# Altium schematic sheet final_sch.SchDoc
size A3; SheetNumber: 1; SheetTotal: 1
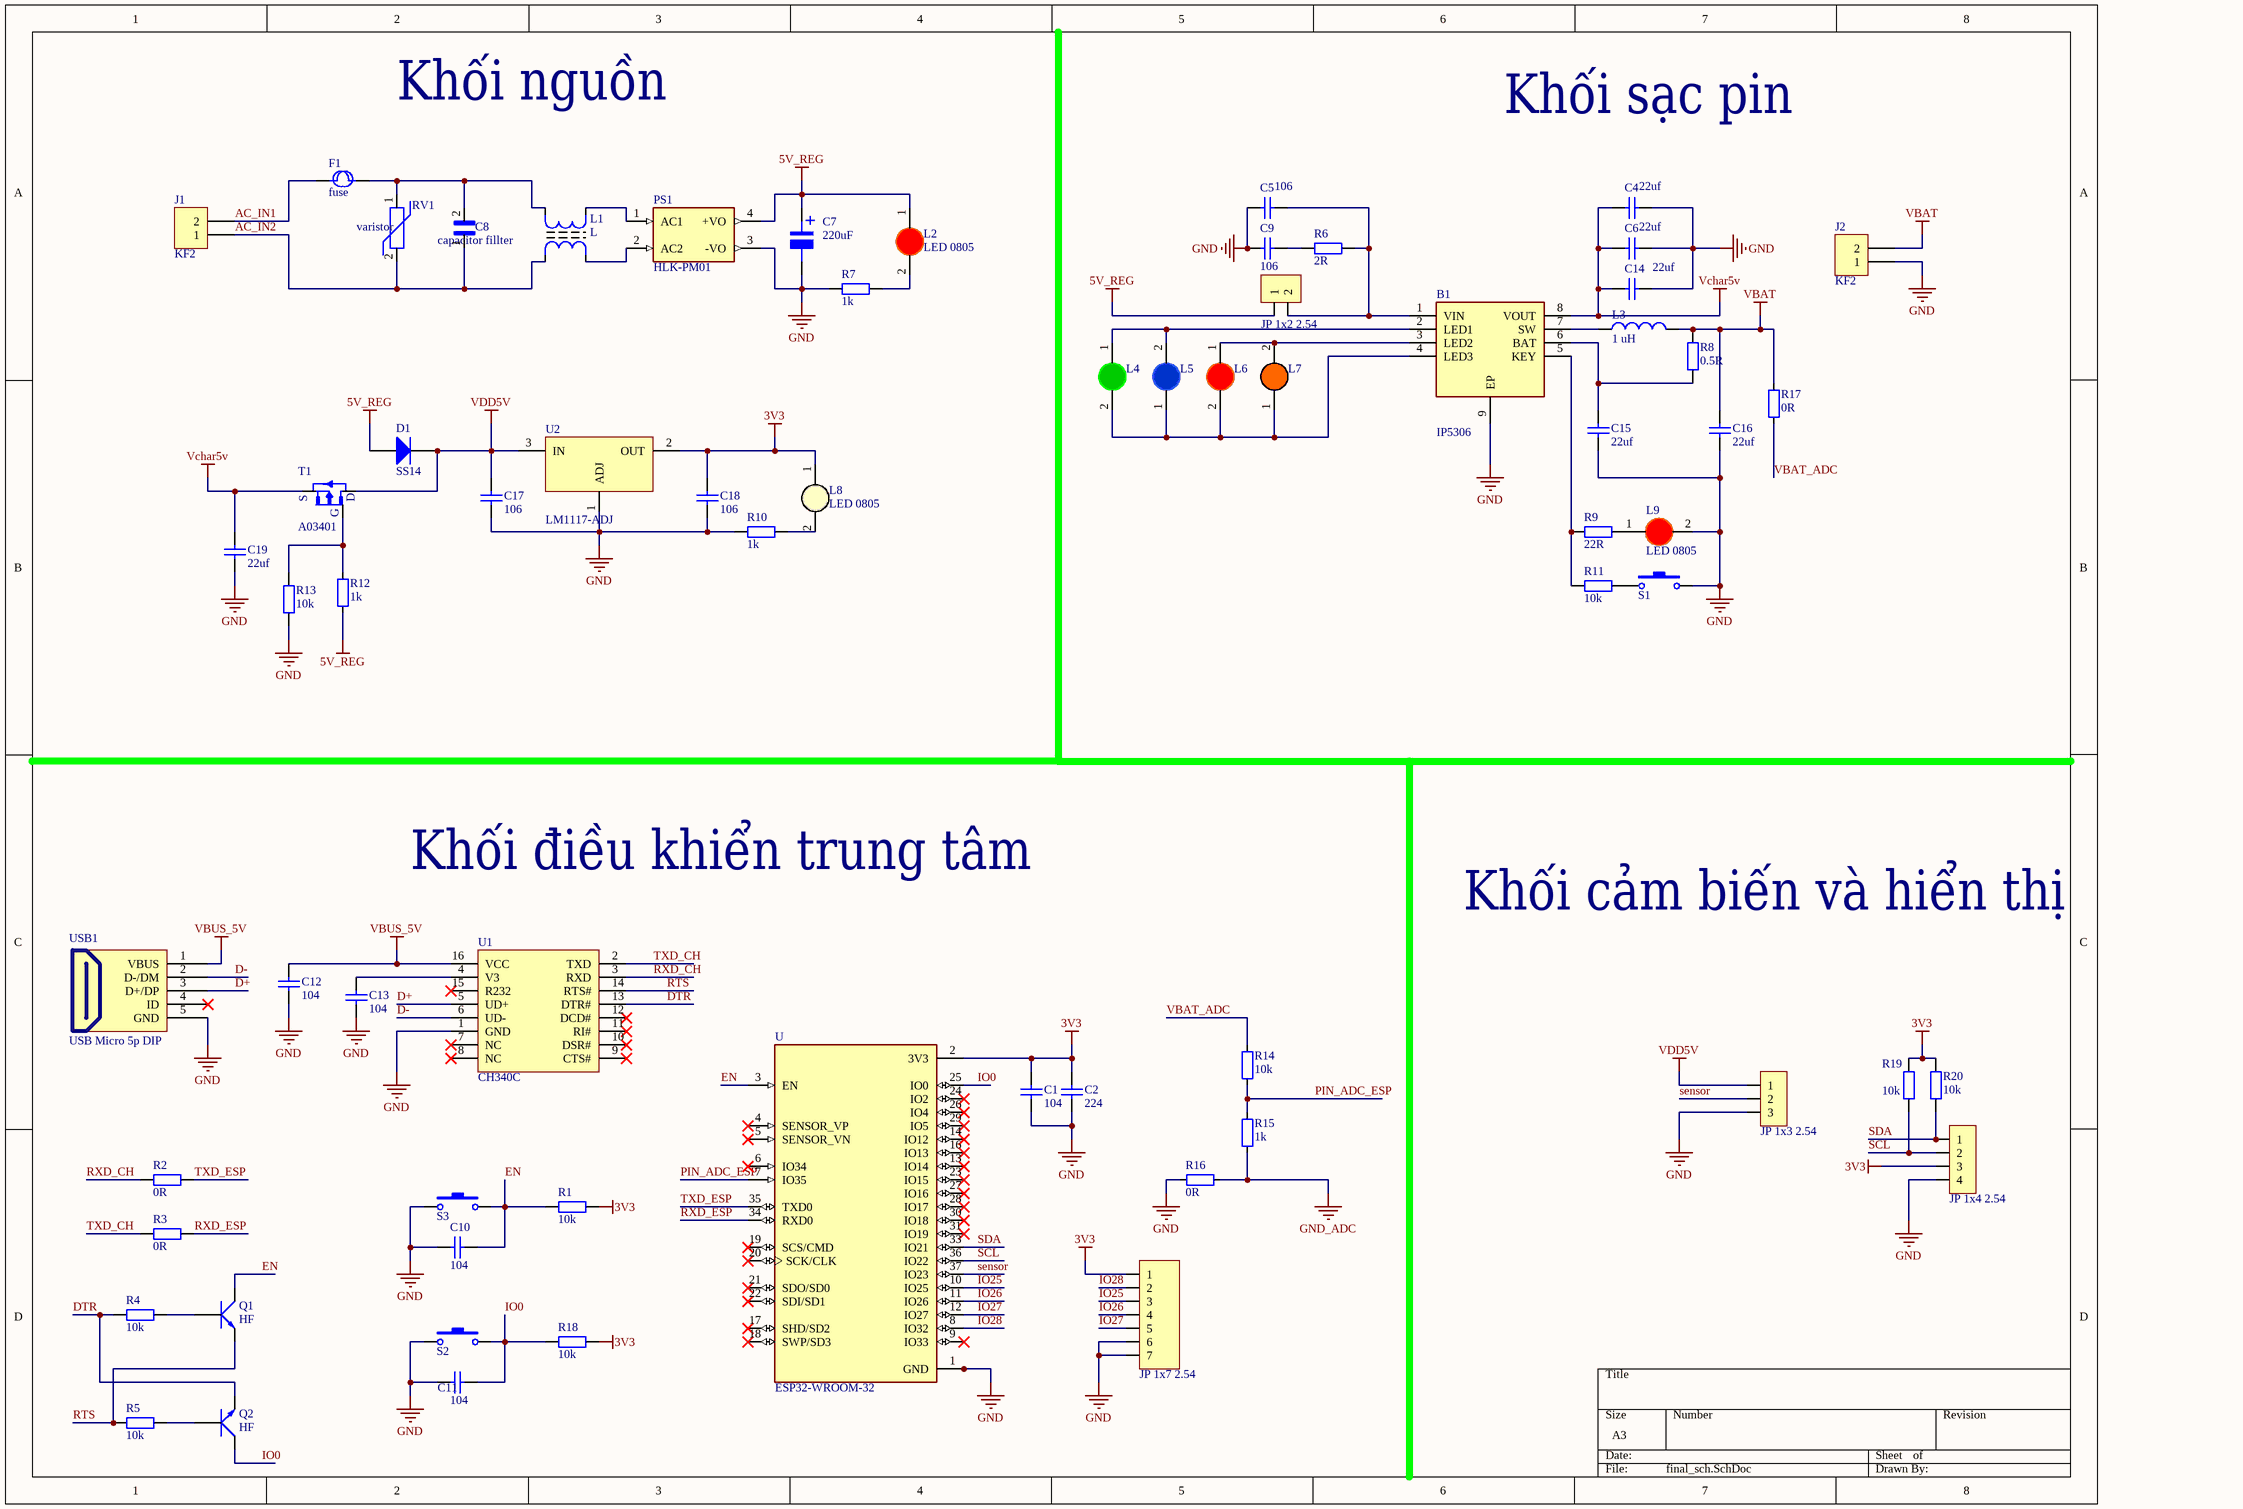
[diagram p0: final_sch.SchDoc]

## Parts
B1  IP5306  [SOIC127P600X165-9N]
C1  104  [tu 0805]
C2  224  [tu 0805]
C4  22uf  [tu 0805]
C5  106  [tu 0805]
C6  22uf  [tu 0805]
C7  220uF  [tu nhom 10 (g)]
C8  capacitor fillter  [CAPRR1000W60L1300T600H1200]
C9  106  [tu 0805]
C10  104  [tu 0805]
C11  104  [tu 0805]
C12  104  [tu 0805]
C13  104  [tu 0805]
C14  22uf  [tu 0805]
C15  22uf  [tu 0805]
C16  22uf  [tu 0805]
C17  106  [tu 0805]
C18  106  [tu 0805]
C19  22uf  [tu 0805]
D1  SS14  [DIODE SMA]
F1  fuse  [F2-5.1-11.4X3.0X18.3MM]
J1  KF2  [KF2-3.5]
J2  KF2  [KF2-3.5]
JP1  JP 1x4 2.54  [JP 1x4 CT]
JP2  JP 1x3 2.54  [JP 1x3 DT]
JP3  JP 1x7 2.54  [JP 1x7 CT]
JP4  JP 1x2 2.54  [JP 1x2 DT]
L1  L  [L-DIP-220]
L2  LED 0805  [LED-0805-Red]
L3  1 uH  [IND_90.5_141.7_125X31_SMD]
L4  (no value)  [LED-0805-Green]
L5  (no value)  [LED-0805-Blue]
L6  (no value)  [LED-0805-Red]
L7  (no value)  [LED-0805-Orange]
L8  LED 0805  [LED-0805-Yellow]
L9  LED 0805  [LED-0805-Red]
PS1  HLK-PM01  [CONV_HLK-PM01]
Q1  HF  [SOT23]
Q2  HF  [SOT23]
R1  10k  [tro smd 0805]
R2  0R  [tro smd 0805]
R3  0R  [tro smd 0805]
R4  10k  [tro smd 0805]
R5  10k  [tro smd 0805]
R6  2R  [tro smd 0805]
R7  1k  [tro smd 0805]
R8  0.5R  [tro smd 0805]
R9  22R  [tro smd 0805]
R10  1k  [tro smd 0805]
R11  10k  [tro smd 0805]
R12  1k  [RES-SMD-0805]
R13  10k  [tro smd 0805]
R14  10k  [RES-SMD-0805]
R15  1k  [RES-SMD-0805]
R16  0R  [RES-SMD-0805]
R17  0R  [RES-SMD-0805]
R18  10k  [tro smd 0805]
R19  10k  [tro smd 0805]
R20  10k  [tro smd 0805]
RV1  varistor  [MOV14D471K]
S1  SW-SMD  [SW-SMD]  (value not drawn)
S2  SW-SMD  [SW-SMD]  (value not drawn)
S3  SW-SMD  [SW-SMD]  (value not drawn)
T1  A03401  [A3401]
U  ESP32-WROOM-32  [MODULE_ESP32-WROOM-32]
U1  CH340C  [SOIC16_50_284_25X90_SMT]
U2  LM1117-ADJ  [LM1117-SOP]
USB1  USB Micro 5p DIP  [USB Micro 5p DIP]

## Nets
3V3: C1.2 C2.1 C18.1 JP1.3 JP3.1 L8.1(A) R1.2 R18.1 R19.1 R20.1 U.2(3V3) U2.2(OUT)
5V_REG: C7.1 D1.1(A) JP4.1 L2.1(A) PS1.4(+VO) R12.1
GND: B1.9(EP) C1.1 C2.2 C4.1 C5.2 C6.1 C7.2 C9.2 C10.2 C11.2 C12.2 C13.2 C14.2 C15.1 C16.2 C17.2 C18.2 C19.2 J2.1 JP1.4 JP2.3 JP3.6 JP3.7 L9.2(K) PS1.3(-VO) R7.2 R10.2 R13.1 R16.2 S1.2 S2.1 S3.1 U.1(GND) U.15(GND) U.38(GND) U.39_1(GND) U.39_2(GND) U.39_3(GND) U.39_4(GND) U.39_5(GND) U.39_6(GND) U.39_7(GND) U.39_8(GND) U.39_9(GND) U.39_10(GND) U.39_11(GND) U.39_12(GND) U.39_13(GND) U.39_14(GND) U.39_15(GND) U.39_16(GND) U.39_17(GND) U.39_18(GND) U.39_19(GND) U.39_20(GND) U.39_21(GND) U1.1(GND) U2.1(ADJ) USB1.5(GND)
GND_ADC: R15.1 R16.1
VBAT: C16.1 J2.2 L3.2 R8.2 R17.1
VBUS_5V: C12.1 U1.16(VCC) USB1.1(VBUS)
Vchar5v: B1.8(VOUT) C4.2 C6.2 C14.1 C19.1 T1.2(S)
VDD5V: C17.1 D1.2(K) JP2.1 T1.3(D) U2.3(IN)
AC_IN1: F1.1 J1.2
AC_IN2: C8.1 J1.1 L1.1 RV1.2
D+: U1.5(UD+) USB1.3(D+/DP)
D-: U1.6(UD-) USB1.2(D-/DM)
DTR: Q2.2(E) R4.2 U1.13(DTR#)
EN: C10.1 Q1.3(C) R1.1 S3.2 U.3(EN)
IO0: C11.1 Q2.3(C) R18.2 S2.2 U.25(IO0)
IO25: JP3.3 U.10(IO25)
IO26: JP3.4 U.11(IO26)
IO27: JP3.5 U.12(IO27)
IO28: JP3.2 U.8(IO32)
PIN_ADC_ESP: R14.1 R15.2 U.7(IO35)
RTS: Q1.2(E) R5.2 U1.14(RTS#)
RXD_CH: R2.1 U1.3(RXD)
RXD_ESP: R3.2 U.34(RXD0)
SCL: JP1.2 R19.2 U.36(IO22)
SDA: JP1.1 R20.2 U.33(IO21)
sensor: JP2.2 U.37(IO23)
TXD_CH: R3.1 U1.2(TXD)
TXD_ESP: R2.2 U.35(TXD0)
VBAT_ADC: R14.2 R17.2
NetB1_1: B1.1(VIN) C5.1 JP4.2 R6.2
NetB1_2: B1.2(LED1) L4.1(A) L5.2(K)
NetB1_3: B1.3(LED2) L6.1(A) L7.2(K)
NetB1_4: B1.4(LED3) L4.2(K) L5.1(A) L6.2(K) L7.1(A)
NetB1_5: B1.5(KEY) R9.1 R11.1
NetB1_6: B1.6(BAT) C15.2 R8.1
NetB1_7: B1.7(SW) L3.1
NetC8_2: C8.2 F1.2 L1.4 RV1.1
NetC9_1: C9.1 R6.1
NetC13_1: C13.1 U1.4(V3)
NetL1_2: L1.2 PS1.2(AC2)
NetL1_3: L1.3 PS1.1(AC1)
NetL2_2: L2.2(K) R7.1
NetL8_2: L8.2(K) R10.1
NetL9_1: L9.1(A) R9.2
NetQ1_1: Q1.1(B) R4.1
NetQ2_1: Q2.1(B) R5.1
NetR11_2: R11.2 S1.1
NetR12_2: R12.2 R13.2 T1.1(G)

Not connected (* = marked no-connect by the designer): U 4(SENSOR_VP)* 5(SENSOR_VN)* 6(IO34)* 9(IO33)* 13(IO14)* 14(IO12)* 16(IO13)* 17(SHD/SD2)* 18(SWP/SD3)* 19(SCS/CMD)* 20(SCK/CLK)* 21(SDO/SD0)* 22(SDI/SD1)* 23(IO15)* 24(IO2)* 26(IO4)* 27(IO16)* 28(IO17)* 29(IO5)* 30(IO18)* 31(IO19)*; U1 7(NC)* 8(NC)* 9(CTS#)* 10(DSR#)* 11(RI#)* 12(DCD#)* 15(R232)*; USB1 4(ID)*

## Notes on the sheet
- Khối nguồn
- Khối sạc pin
- Khối điều khiển trung tâm
- Khối cảm biến và hiển thị
- (in symbol Tu Nhom 220uF 50V) +

## Library data of the parts
B1 = IP5306: Fully-Integrated Power-Bank System-On-Chip; Manufacturer_Name: INJOINIC; Geometry.Height: 1.65mm; Manufacturer_Part_Number: IP5306; Mouser Part Number: *; Mouser Price/Stock: *; Arrow Part Number: *; Arrow Price/Stock: *; Datasheet Link: https://datasheetspdf.com/pdf-file/1139129/Injoinic/IP5306/1
C1 C10-C13 = Tu 0805 104 50V 10%: Dán; Don_Vi: Con; So_Chan: 2; Ten_Linh_Kien: Tụ 0805 104-100nF 10% 50V; Ma_Hang: MH004551; Chung_Loai: Dán; Kieu_Chan: *
C2 = Tu 0805 224 50V 10%: Dán; Don_Vi: Con; So_Chan: 2; Ten_Linh_Kien: Tụ 0805 224-0.22uF 10% 50V; Ma_Hang: MH004559; Chung_Loai: Dán; Kieu_Chan: *
C4 C6 C14-C16 C19 = Tu 0805 225 25V 10%: Dán; Don_Vi: Con; So_Chan: 2; Ten_Linh_Kien: Tụ 0805 225-2.2uF 25V 10%; Ma_Hang: MH007483; Chung_Loai: Dán; Kieu_Chan: *
C5 C9 C17 C18 = Tu 0805 106 16V 10%: Dán; Ten_Linh_Kien: Tụ 0805 106-10uF 10% 16V; So_Chan: 2; Don_Vi: Con; Ma_Hang: MH004553; Chung_Loai: Dán; Kieu_Chan: *
C7 = Tu Nhom 220uF 50V: Dán; Don_Vi: Con; So_Chan: 2; Ten_Linh_Kien: Tụ Nhôm 220uF 50V 10x10.2MM; Ma_Hang: MH002228; Chung_Loai: Dán; Kieu_Chan: *
C8 = B32921C3104M003: Safety Capacitors FILM CAP MKP X2 0.10uF 20% 305Vac LS 10mm - short leads; MF: TDK; Package: None; Price: None; MP: B32921C3104M003; Availability: In Stock; Value: *; Check_prices: https://www.snapeda.com/parts/B32921C3104M003/TDK/view-part/?ref=eda; Purchase-URL: https://pricing.snapeda.com/search/part/B32921C3104M003/?ref=eda; SnapEDA_Link: https://www.snapeda.com/parts/B32921C3104M003/TDK/view-part/?ref=snap
D1 = Diode SS14 ( 1N5819): Dán; Ma_Hang: MH002211; Don_Vi: Con; Ten_Linh_Kien: Diode SS14 DO214 Schottky 1A 40V ( 1N5819 DO214); Chung_Loai: Dán; Ghi_Chu: *; Kieu_Chan: *
F1 = DIP-PPTC-2.5A-30V(D11.4MM): Polymeric PTC Resettable Fuse 30V 2.5A Ih Through Hole Radial, Disc; MF: Littelfuse; MP: 30R250; Value: *; Price: None; Package: Radial Littelfuse; SnapEDA_Link: https://www.snapeda.com/parts/30R250/Littelfuse/view-part/4772985/?ref=snap; Availability: Bad; Check_prices: https://www.snapeda.com/parts/30R250/Littelfuse/view-part/4772985/?ref=eda
J1 J2 = KF2: Manufacturer: Würth Elektronik eiSos GmbH; partNo: 691103110002; ComponentLink1 Description: Manufacturer; ComponentLink2 Description: Datasheet; NoPins: 2; Created Date: 29 October 2013; ComponentLink1URL: http://www.we-online.com; ComponentLink2URL: http://katalog.we-online.de/em/datasheet/6911031100xx.pdf; Created by: Karrer Zheng
JP1 = JP 1x4 2.54 Cai Thang: Cắm; Ten_Linh_Kien: Jump Đơn Cái 2.54MM 1x20P Thẳng; Don_Vi: Con; Ma_Hang: MH004006; Ghi_Chu: *; Kieu_Chan: *; Chung_Loai: Cắm
JP2 = JP 1x3 2.54 Duc Thang: Cắm; Ten_Linh_Kien: Jump Đơn Đực 2.54MM 1x40P Thẳng 11MM; Don_Vi: Con; Ma_Hang: MH000903; Ghi_Chu: *; Kieu_Chan: *; Chung_Loai: Cắm
JP3 = JP 1x7 2.54 Cai Thang: Cắm; Ten_Linh_Kien: Jump Đơn Cái 2.54MM 1x20P Thẳng; Don_Vi: Con; Ma_Hang: MH004006; Ghi_Chu: *; Kieu_Chan: *; Chung_Loai: Cắm
JP4 = JP 1x2 2.54 Duc Thang: Cắm; Ten_Linh_Kien: Jump Đơn Đực 2.54MM 1x40P Thẳng 11MM; Don_Vi: Con; Ma_Hang: MH000903; Ghi_Chu: *; Kieu_Chan: *; Chung_Loai: Cắm
L1 = L-DIP-220: Inductor; Value: Loc 220; Designed by: VanDungEvn
L2 L6 L9 = LED 0805 Do: Dán; Don_Vi: Con; Ma_Hang: MH000897; Ten_Linh_Kien: LED 0805 Màu Đỏ (Red); Ghi_Chu: *; Kieu_Chan: *; Chung_Loai: Dán
L3 = IND_1uH-4.2A-20%-SMD: Fixed Inductors WPN3012H1R0MT 100kHz; Manufacturer: Sunlord; Alternate Part Number-1: NA; Manufacturer Part Number: WPN3012H1R0MT; Case/Package: SMD; Supplier-1: NA; Supplier Part Number-1: NA
L4 = LED 0805 Xanh La: Dán; Don_Vi: Con; Ma_Hang: MH002326; Ten_Linh_Kien: LED 0805 Màu Xanh Lá (Green); Ghi_Chu: *; Kieu_Chan: *; Chung_Loai: Dán
L5 = LED 0805 Xanh Duong: Dán; Don_Vi: Con; Ma_Hang: MH002327; Ten_Linh_Kien: LED 0805 Màu Xanh Dương (Blue); Ghi_Chu: *; Kieu_Chan: *; Chung_Loai: Dán
L7 = LED 0805 Cam: Dán; Don_Vi: Con; Ma_Hang: MH002328; Ten_Linh_Kien: LED 0805 Màu Cam ( Orange); Ghi_Chu: *; Kieu_Chan: *; Chung_Loai: Dán
L8 = LED 0805 Trang: Dán; Don_Vi: Con; Ma_Hang: MH002946; Ten_Linh_Kien: LED 0805 Màu Trắng ( White); Ghi_Chu: *; Kieu_Chan: *; Chung_Loai: Dán
PS1 = HLK-PM01: The HLK-PM01 is a small size low cost AC to DC converter which can take in 110V/220V AC at 50/60 Hz and give 5V 3W output. The module is can be used in designs which run on 5V and needs to be powered form the AC mains.; MF: Hi-link; Package: None; Price: None; Value: *; SnapEDA_Link: https://www.snapeda.com/parts/hlk-pm01/Hi-link/view-part/?ref=snap; MP: hlk-pm01; Availability: Not in stock; Check_prices: https://www.snapeda.com/parts/hlk-pm01/Hi-link/view-part/?ref=eda
Q1 Q2 = C1815 HF SMD: NPN transistor; Value: C9014
R1 R4 R5 R18 = Tro 0805 5% 10k: Dán; Don_Vi: Con; So_Chan: 2; Ten_Linh_Kien: Trở 0805 5% 10k; Ma_Hang: MH005239; Chung_Loai: Dán; Kieu_Chan: *
R2 R3 = Tro 0805 5% 0R: Dán; Don_Vi: Con; So_Chan: 2; Ten_Linh_Kien: Trở 0805 5% 0R; Ma_Hang: MH005230; Chung_Loai: Dán; Kieu_Chan: *
R6 = Tro 0805 5% 1R: Dán; Don_Vi: Con; So_Chan: 2; Ten_Linh_Kien: Trở 0805 5% 1R; Ma_Hang: MH005236; Chung_Loai: Dán; Kieu_Chan: *
R7 R10 = Tro 0805 1% 1k: Dán; Don_Vi: Con; So_Chan: 2; Ten_Linh_Kien: Trở 0805 1% 1k; Ma_Hang: MH005468; Chung_Loai: Dán; Kieu_Chan: *
R8 = Tro 0805 1% 0.5R: Dán; Don_Vi: Con; So_Chan: 2; Ten_Linh_Kien: Trở 0805 1% 0.5R; Ma_Hang: MH005465; Chung_Loai: Dán; Kieu_Chan: *
R9 = Tro 0805 5% 22R: Dán; Don_Vi: Con; So_Chan: 2; Ten_Linh_Kien: Trở 0805 5% 22R; Ma_Hang: MH005249; Chung_Loai: Dán; Kieu_Chan: *
R11 R13 R19 R20 = Tro 0805 1% 10k: Dán; Don_Vi: Con; So_Chan: 2; Ten_Linh_Kien: Trở 0805 1% 10k; Ma_Hang: MH005473; Chung_Loai: Dán; Kieu_Chan: *
R12 R14-R17 = Resistor - SMD: Resistor; Manufacturer: Generic Components; Class: Passive; Published: 08/06/2000; Publisher: Altium Hobart Technology Centre
RV1 = MOV-14D471K: 470 V 4.5 kA Varistor 1 Circuit Through Hole Disc 14mm; MF: Bourns; Price: None; MP: MOV-14D471K; SnapEDA_Link: https://www.snapeda.com/parts/MOV-14D471K/Bourns/view-part/?ref=snap; Package: Disc-14 Bourns; Availability: In Stock; Check_prices: https://www.snapeda.com/parts/MOV-14D471K/Bourns/view-part/?ref=eda; Purchase-URL: https://pricing.snapeda.com/search/part/MOV-14D471K/?ref=eda; Value: *
S1-S3 = SW-SMD: Switch; Published: 24-Mar-1999; LatestRevisionDate: 17-Jul-2002; LatestRevisionNote: Re-released for DXP Platform.; PackageReference: SPST-2; Publisher: Altium Limited
T1 = A03401: P-Channel 30V 4A _Ta_ 1.4W _Ta_ Surface Mount SOT-23-3
U = ESP32-WROOM-32: Bluetooth, WiFi Transceiver Module 2.4GHz ~ 2.5GHz Surface Mount; MF: Espressif Systems; Package: Module Espressif Systems; Digi-Key_Part_Number: 1904-1010-1-ND; Digi-Key_Purchase_URL: https://www.digikey.com/product-detail/en/espressif-systems/ESP32-WROOM-32/1904-1010-1-ND/8544305?utm_source=snapeda&utm_medium=aggregator&utm_campaign=symbol; Value: *; MP: ESP32-WROOM-32; SnapEDA_Link: https://www.snapeda.com/parts/ESP32-WROOM-32/Espressif%20Systems/view-part/2753322/?ref=snap
U1 = CH340C: USB Bridge, USB to UART USB 2.0 UART Interface; Manufacturer: Olimex; Alternate Part Number-1: NA; Manufacturer Part Number: CH340C; Case/Package: SOIC16; Supplier-1: LCSC; Supplier Part Number-1: C84681
U2 = LM1117-ADJ: 800mA Low-Dropout Linear Regulator; Creator: Nguyen Ba Bien; Website: http://group3i.net
USB1 = USB Micro 5p DIP: USB Type B; Ten: MicroUSB MK5P DIP; Ma_Hang: MH005145